# EAGLE design Wio Terminal Chassis - LoRa-E5 and GNSS v1.2 (EAGLE 6.4)
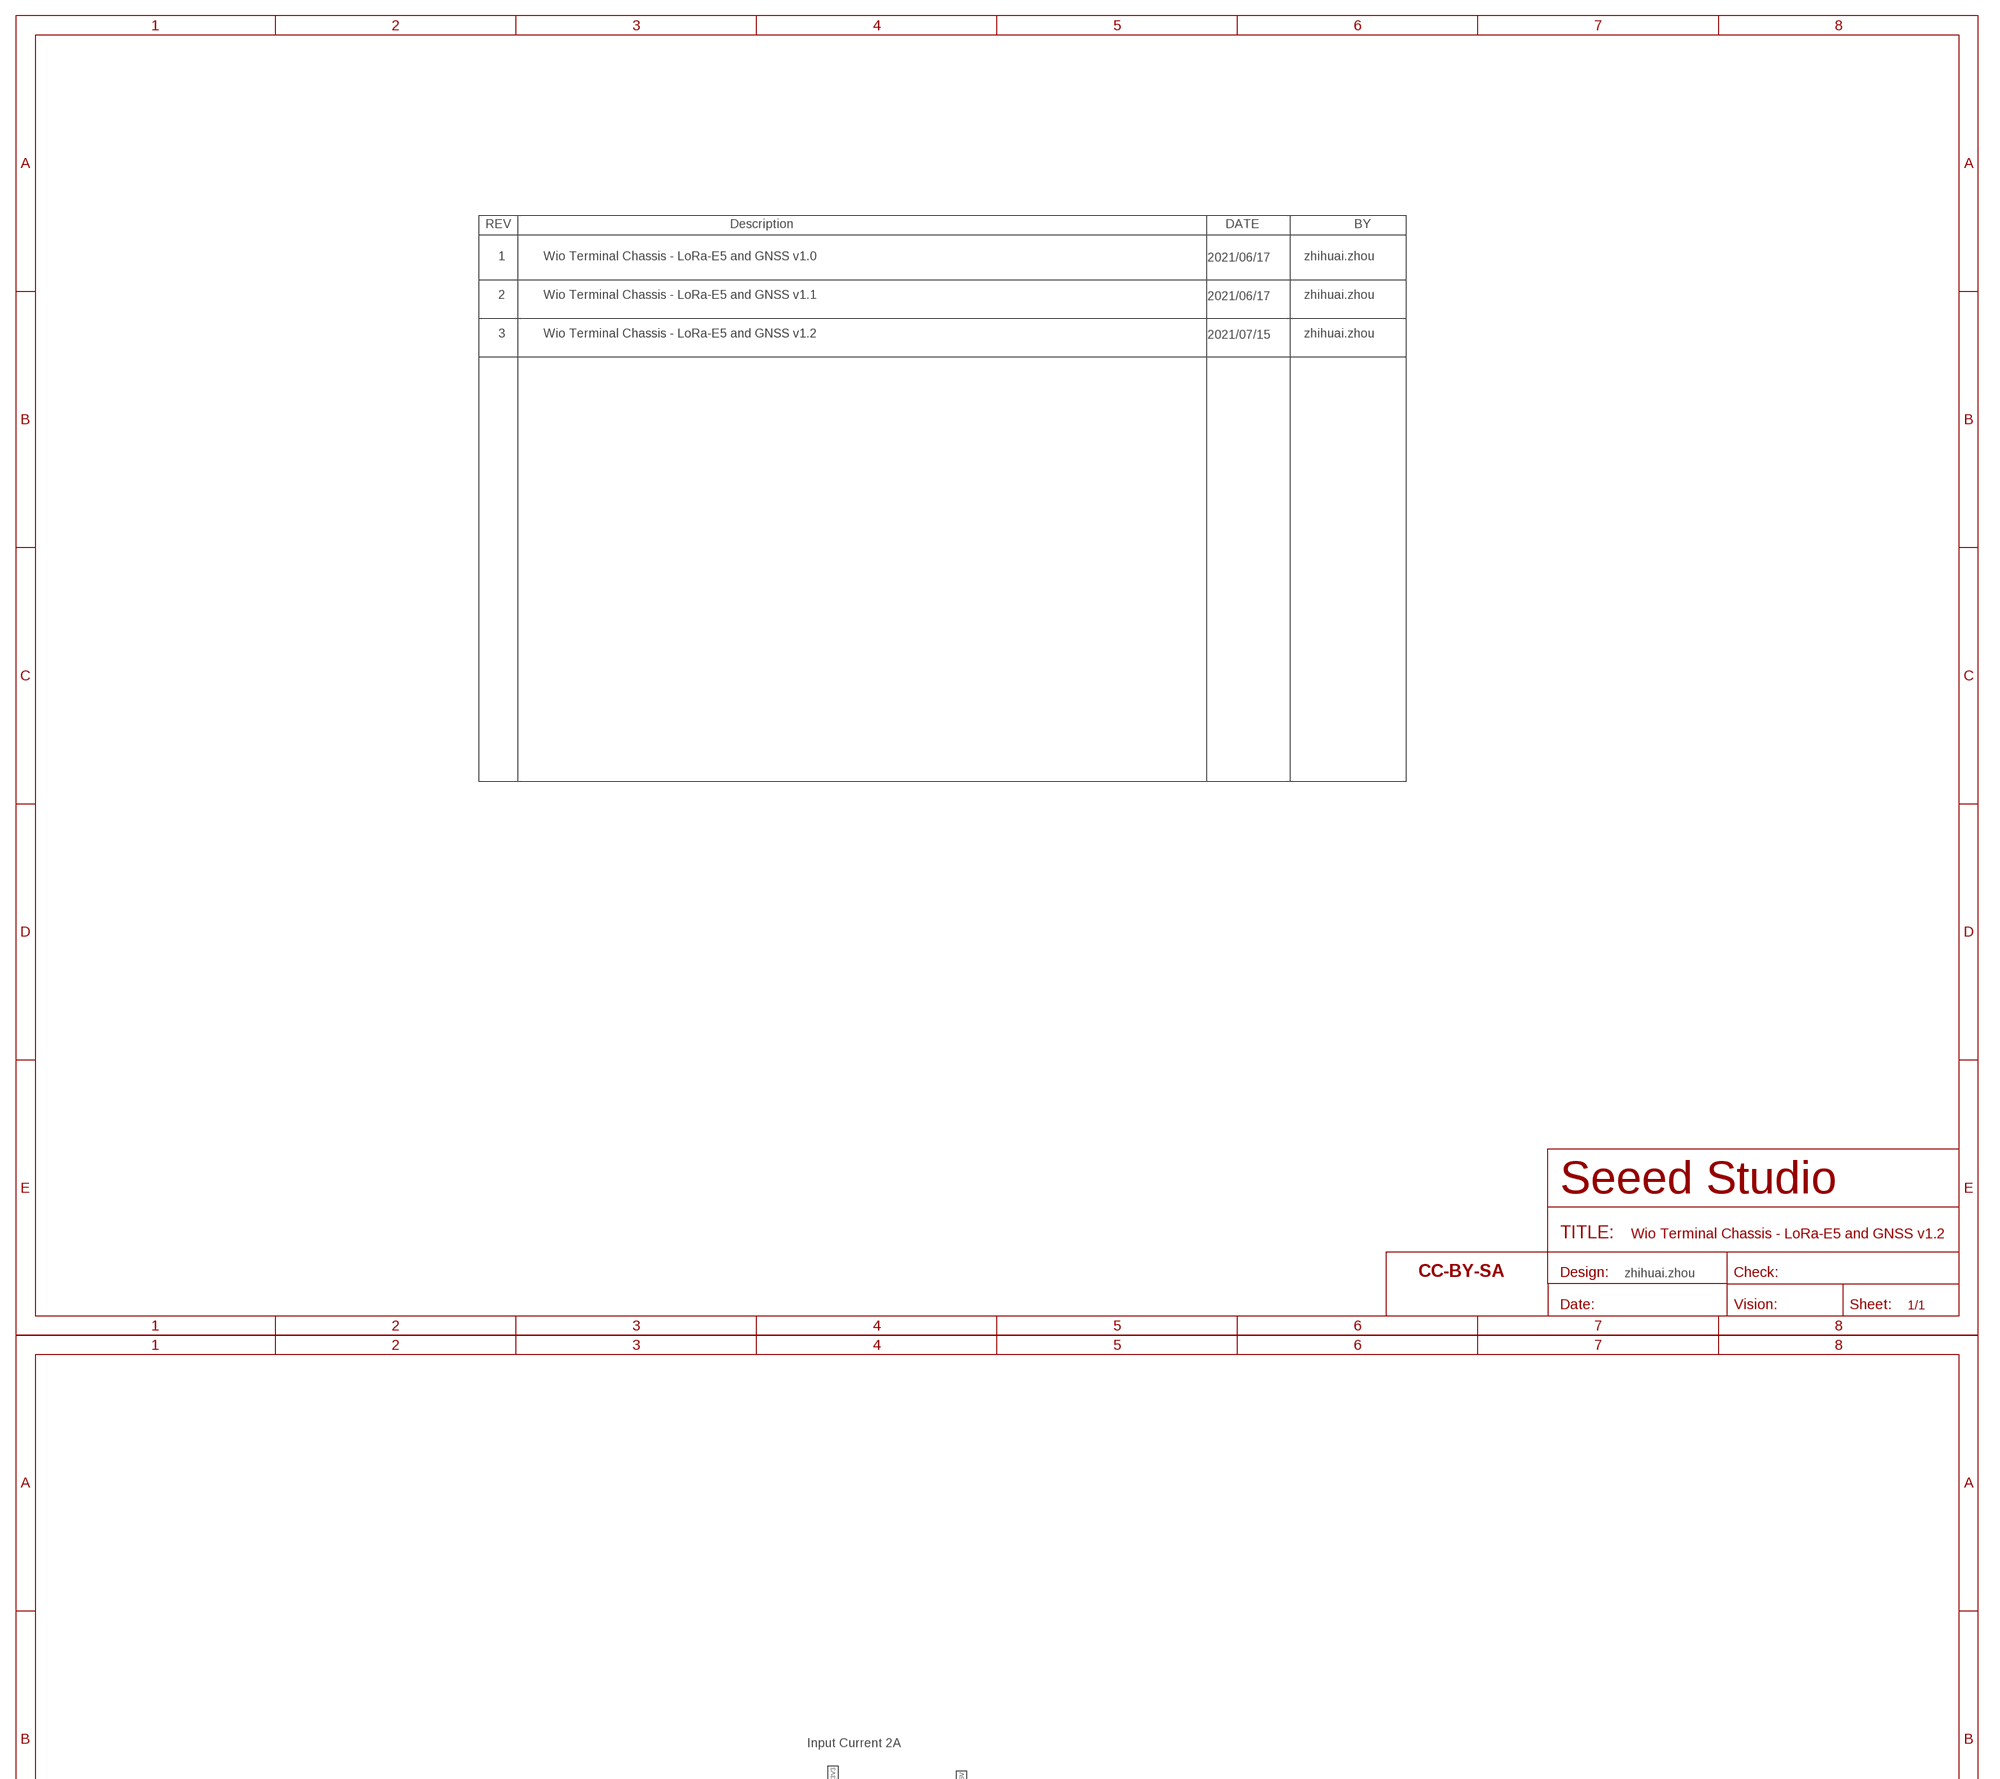
[diagram p0: schematic, sheet 1, part 1 of 2]
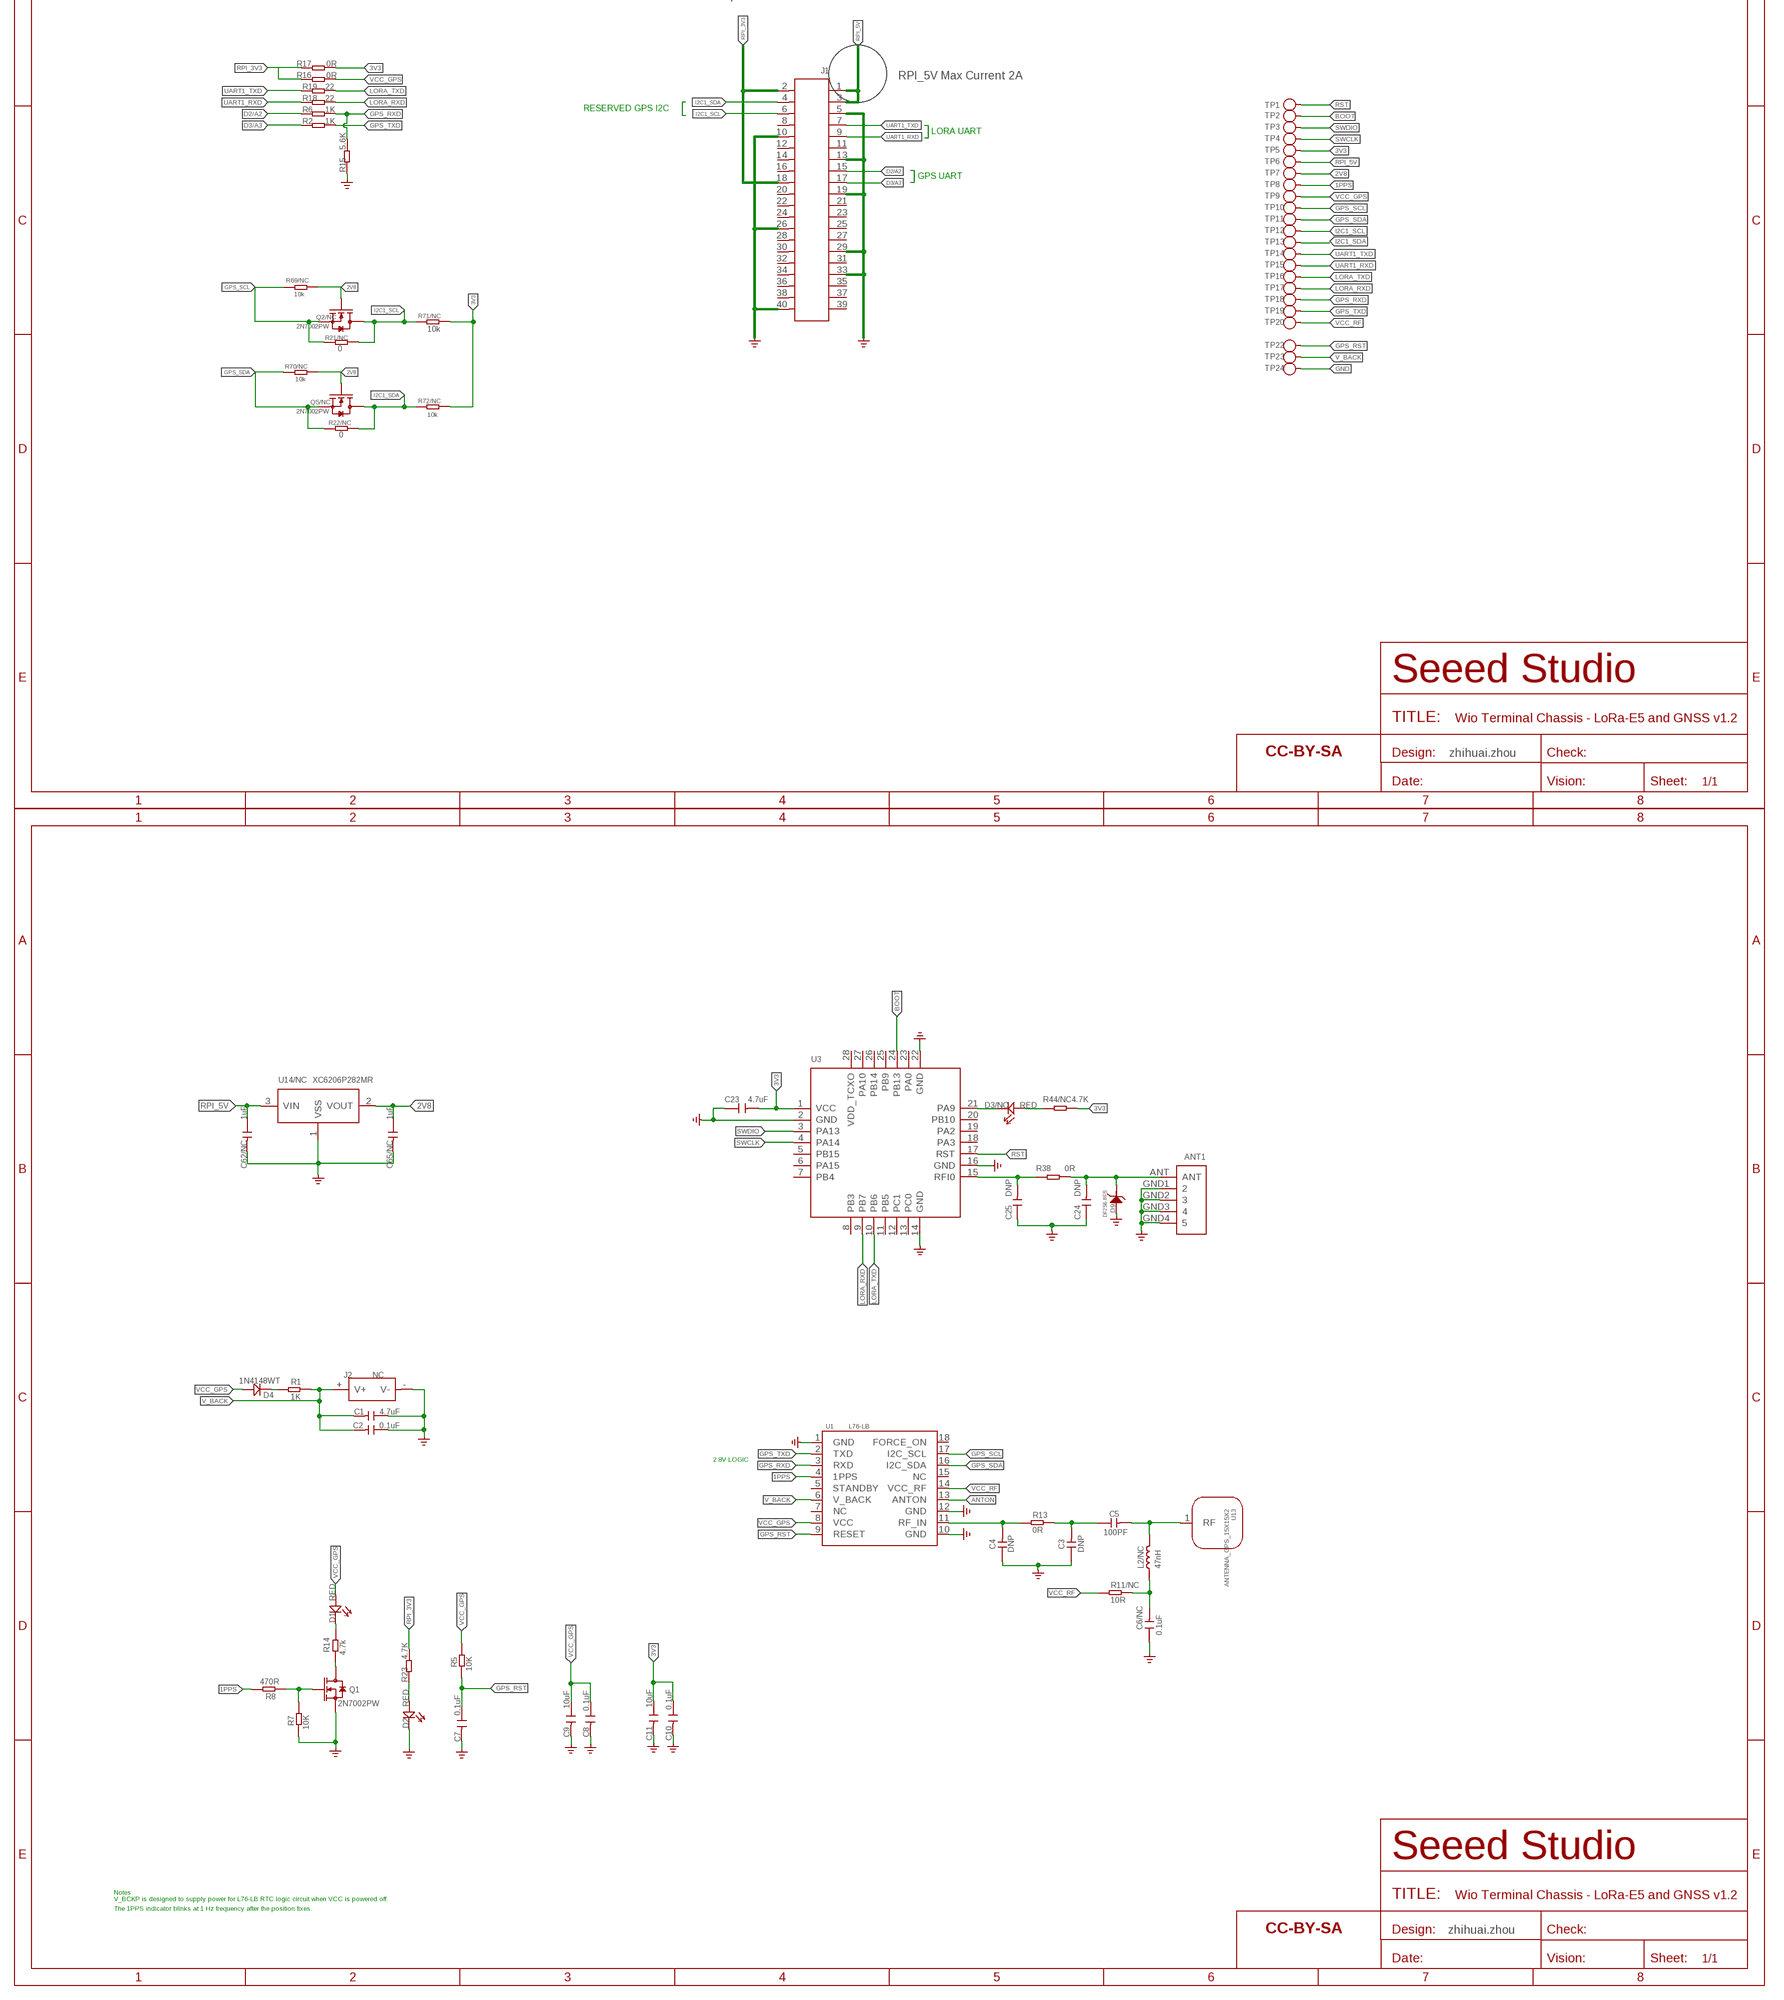
[diagram p1: schematic, sheet 1, part 2 of 2]

## Parts
ANT1  ANTENNA-SMA-MCX-JE-320160125  [SMA5P-SMD-5.1-6.5X6.5X16.5MM]
C1  4.7uF  CAP-0603  [C0603]
C2  0.1uF  CAP-0603  [C0603]
C3  DNP  CAP-0603  [C0603]
C4  DNP  CAP-0603  [C0603]
C5  100PF  CAP-0603  [C0603]
C6/NC  0.1uF  CAP-0603  [C0603]
C7  0.1uF  CAP-0603  [C0603]
C8  0.1uF  CAP-0603  [C0603]
C9  10uF  CAP-0603  [C0603]
C10  0.1uF  CAP-0603  [C0603]
C11  10uF  CAP-0603  [C0603]
C23  4.7uF  CAP-0603  [C0603]
C24  DNP  CAP-0603  [C0603]
C25  DNP  CAP-0603  [C0603]
C62/NC  1uF  CAP-0603  [C0603]
C65/NC  1uF  CAP-0603  [C0603]
D1  RED  LED'0603'  [LED-0603]
D2  RED  LED'0603'  [LED-0603]
D3/NC  RED  LED'0603'  [LED-0603]
D4  1N4148WT  DIODE'0805'  [SOD-323]
D9  DF2S6.8FS  D-ESD-2P'DF2S6.8FS'  [SOD-923]
J1  HEADER-2X20P-SMD-SMD  [H2X20-SMD-2.54]
J2  NC  HOLDER-BAT  [SMD-CR1220-2]
L2/NC  47nH  INDUCTOR/FERRITE-BEAD'0603'  [L0603]
Q1  2N7002PW  MOSFET-N-SOT23  [SOT-23]
Q2/NC  2N7002PW  MOSFET-N-SOT23  [SOT-23]
Q5/NC  2N7002PW  MOSFET-N-SOT23  [SOT-23]
R1  1K  RES-0603  [R0603]
R2  1K  RES-0603  [R0603]
R5  10K  RES-0603  [R0603]
R6  1K  RES-0603  [R0603]
R7  10K  RES-0603  [R0603]
R8  470R  RES-0603  [R0603]
R11/NC  10R  RES-0603  [R0603]
R13  0R  RES-0603  [R0603]
R14  4.7k  RES-0603  [R0603]
R15  5.6K  RES-0603  [R0603]
R16  0R  RES-0603  [R0603]
R17  0R  RES-0603  [R0603]
R18  22  RES-0603  [R0603]
R19  22  RES-0603  [R0603]
R21/NC  0  RES-0603  [R0603]
R22/NC  0  RES-0603  [R0603]
R23  4.7K  RES-0603  [R0603]
R38  0R  RES-0603  [R0603]
R44/NC  4.7K  RES-0603  [R0603]
R69/NC  10k  RES-0603  [R0603]
R70/NC  10k  RES-0603  [R0603]
R71/NC  10k  RES-0603  [R0603]
R72/NC  10k  RES-0603  [R0603]
TP1  TEST  TEST-POINT'4545'  [TP-D45MIL]
TP2  TEST  TEST-POINT'4545'  [TP-D45MIL]
TP3  TEST  TEST-POINT'4545'  [TP-D45MIL]
TP4  TEST  TEST-POINT'4545'  [TP-D45MIL]
TP5  TEST  TEST-POINT'4545'  [TP-D45MIL]
TP6  TEST  TEST-POINT'4545'  [TP-D45MIL]
TP7  TEST  TEST-POINT'4545'  [TP-D45MIL]
TP8  TEST  TEST-POINT'4545'  [TP-D45MIL]
TP9  TEST  TEST-POINT'4545'  [TP-D45MIL]
TP10  TEST  TEST-POINT'4545'  [TP-D45MIL]
TP11  TEST  TEST-POINT'4545'  [TP-D45MIL]
TP12  TEST  TEST-POINT'4545'  [TP-D45MIL]
TP13  TEST  TEST-POINT'4545'  [TP-D45MIL]
TP14  TEST  TEST-POINT'4545'  [TP-D45MIL]
TP15  TEST  TEST-POINT'4545'  [TP-D45MIL]
TP16  TEST  TEST-POINT'4545'  [TP-D45MIL]
TP17  TEST  TEST-POINT'4545'  [TP-D45MIL]
TP18  TEST  TEST-POINT'4545'  [TP-D45MIL]
TP19  TEST  TEST-POINT'4545'  [TP-D45MIL]
TP20  TEST  TEST-POINT'4545'  [TP-D45MIL]
TP22  TEST  TEST-POINT'4545'  [TP-D45MIL]
TP23  TEST  TEST-POINT'4545'  [TP-D45MIL]
TP24  TEST  TEST-POINT'4545'  [TP-D45MIL]
U1  L76-LB  GPS_MODULE_L76-LB  [GPS_MODULE_L76-LB]
U3  MOUDLE_LORA_E5  [MOUDLE28P-1.25-12X12X2.5MM]
U13  ANTENNA_GPS_15X15X2  [ANTENNA_GPS_15X15X2]
U14/NC  XC6206P282MR  PMIC-XC6206PMR  [SOT-23]

## Nets
1PPS: R8.2 TP8.T U1.4(1PPS)
2V8: C65/NC.1 Q2/NC.1(G) Q5/NC.1(G) R69/NC.2 R70/NC.2 TP7.T U14/NC.2(VOUT)
3V3: C10.1 C11.1 C23.2 R17.2 R44/NC.2 R71/NC.2 R72/NC.2 TP5.T U3.1(VCC)
ANTON: U1.13(ANTON)
BOOT: TP2.T U3.24(PB13)
D2/A2: J1.15 R6.1
D3/A3: J1.17 R2.1
GND: ANT1.GND1 ANT1.GND2 ANT1.GND3 ANT1.GND4 C1.1 C2.1 C3.1 C4.1 C6/NC.1 C7.2 C8.2 C9.2 C10.2 C11.2 C23.1 C24.1 C25.1 C62/NC.2 C65/NC.2 D2.- D9.2 J1.5 J1.10 J1.13 J1.19 J1.26 J1.29 J1.33 J1.40 J2.-(V-) Q1.2(S) R7.1 R15.1 TP24.T U1.1(GND) U1.10(GND) U1.12(GND) U3.2(GND) U3.14(GND) U3.16(GND) U3.22(GND) U14/NC.1(VSS) ; supply symbol labelled GND_POWER
GPS_RST: C7.1 R5.1 TP22.T U1.9(RESET)
GPS_RXD: R6.2 R15.2 TP18.T U1.3(RXD)
GPS_SCL: Q2/NC.2(S) R21/NC.1 R69/NC.1 TP10.T U1.17(I2C_SCL)
GPS_SDA: Q5/NC.2(S) R22/NC.1 R70/NC.1 TP11.T U1.16(I2C_SDA)
GPS_TXD: R2.2 TP19.T U1.2(TXD)
I2C1_SCL: J1.6 Q2/NC.3(D) R21/NC.2 R71/NC.1 TP12.T
I2C1_SDA: J1.4 Q5/NC.3(D) R22/NC.2 R72/NC.1 TP13.T
LORA_RXD: R18.2 TP17.T U3.9(PB7)
LORA_TXD: R19.2 TP16.T U3.10(PB6)
N$7: Q1.3(D) R14.2
N$8: Q1.1(G) R7.2 R8.1
N$10: D1.- R14.1
N$11: D4.- R1.1
N$15: C6/NC.2 L2/NC.1 R11/NC.2
N$16: C4.2 R13.1 U1.11(RF_IN)
N$18: C5.2 L2/NC.2 U13.1(RF)
N$19: C3.2 C5.1 R13.2
N$20: D2.+ R23.1
N$26: ANT1.ANT C24.2 D9.1 R38.2
N$40: C25.2 R38.1 U3.15(RFI0)
N$45: D3/NC.+ R44/NC.1
N$48: D3/NC.- U3.21(PA9)
RPI_3V3: J1.2 J1.18 R16.1 R17.1 R23.2
RPI_5V: C62/NC.1 J1.1 J1.3 TP6.T U14/NC.3(VIN)
RST: TP1.T U3.17(RST)
SWCLK: TP4.T U3.4(PA14)
SWDIO: TP3.T U3.3(PA13)
UART1_RXD: J1.9 R18.1 TP15.T
UART1_TXD: J1.7 R19.1 TP14.T
V_BACK: C1.2 C2.2 J2.+(V+) R1.2 TP23.T U1.6(V_BACK)
VCC_GPS: C8.1 C9.1 D1.+ D4.+ R5.2 R16.2 TP9.T U1.8(VCC)
VCC_RF: R11/NC.1 TP20.T U1.14(VCC_RF)
Unconnected: J1.8 J1.11 J1.12 J1.14 J1.16 J1.20 J1.21 J1.22 J1.23 J1.24 J1.25 J1.27 J1.28 J1.30 J1.31 J1.32 J1.34 J1.35 J1.36 J1.37 J1.38 J1.39 U1.5(STANDBY) U1.7(NC) U1.15(NC) U1.18(FORCE_ON) U3.5(PB15) U3.6(PA15) U3.7(PB4) U3.8(PB3) U3.11(PB5) U3.12(PC1) U3.13(PC0) U3.18(PA3) U3.19(PA2) U3.20(PB10) U3.23(PA0) U3.25(PB9) U3.26(PB14) U3.27(PA10) U3.28(VDD_TCXO)

## Notes on the sheet
- 1 | Wio Terminal Chassis - LoRa-E5 and GNSS v1.0 | 2021/06/17 | zhihuai.zhou
- 2 | Wio Terminal Chassis - LoRa-E5 and GNSS v1.1 | 2021/06/17 | zhihuai.zhou
- 3 | Wio Terminal Chassis - LoRa-E5 and GNSS v1.2 | 2021/07/15 | zhihuai.zhou
- zhihuai.zhou
- Input Current 2A
- RPI_5V Max Current 2A
- RESERVED GPS I2C
- LORA UART
- GPS UART
- zhihuai.zhou
- 2.8V LOGIC
- Notes:
  V_BCKP is designed to supply power for L76-LB RTC logic circuit when VCC is powered off.
- The 1PPS indicator blinks at 1 Hz frequency after the position fixes.
- zhihuai.zhou

## Library data of the parts
ANT1 = ANTENNA-SMA-MCX-JE:ANTENNA-SMA-MCX-JE
C1-C5 C6/NC C7-C11 C23-C25 C62/NC C65/NC = Discrete-new:CAP: Ceramic Capacitors
D1 D2 D3/NC = Discrete-new:LED
D4 = Discrete-new:DIODE
D9 = Discrete-new:D-ESD-2P: SOD-923:304060009;SOD-123:304060001
J1 = HEADER-2X20P-SMD:HEADER-2X20P-SMD
J2 = HOLDER-BAT:HOLDER-BAT: button cell holder
L2/NC = Discrete-new:INDUCTOR/FERRITE-BEAD
Q1 Q2/NC Q5/NC = Discrete-new:MOSFET-N: IRLL014: http://www.vishay.com/docs/91319/sihll014.pdf
R1 R2 R5-R8 R11/NC R13-R19 R21/NC R22/NC R23 R38 R44/NC R69/NC R70/NC R71/NC R72/NC = Discrete-new:RES
TP1-TP20 TP22-TP24 = Discrete-new:TEST-POINT; PARTNO: DNP
U1 = GPS_MODULE_L76-LB:GPS_MODULE_L76-LB
U3 = MOUDLE_LORA_E5:MOUDLE_LORA_E5
U13 = ANTENNA_GPS_15X15X2:ANTENNA_GPS_15X15X2
U14/NC = IC-new:PMIC-XC6206P: LOW ESR Cap.Compatible Positive Voltage Regulators

## Board
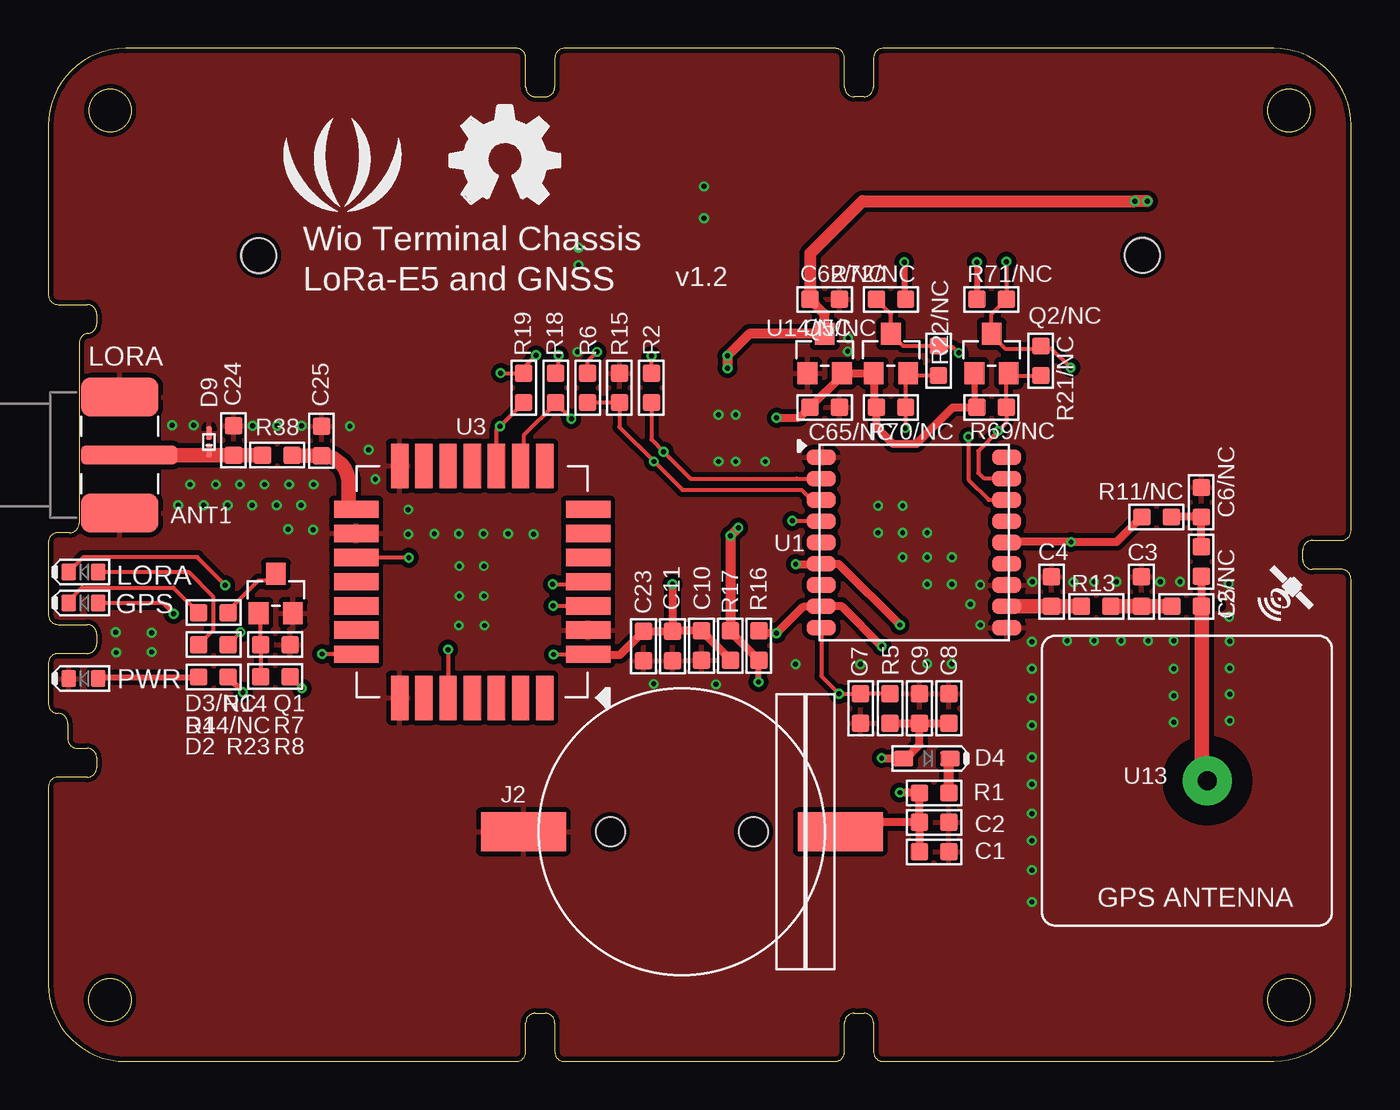
[diagram p2: board, top side]
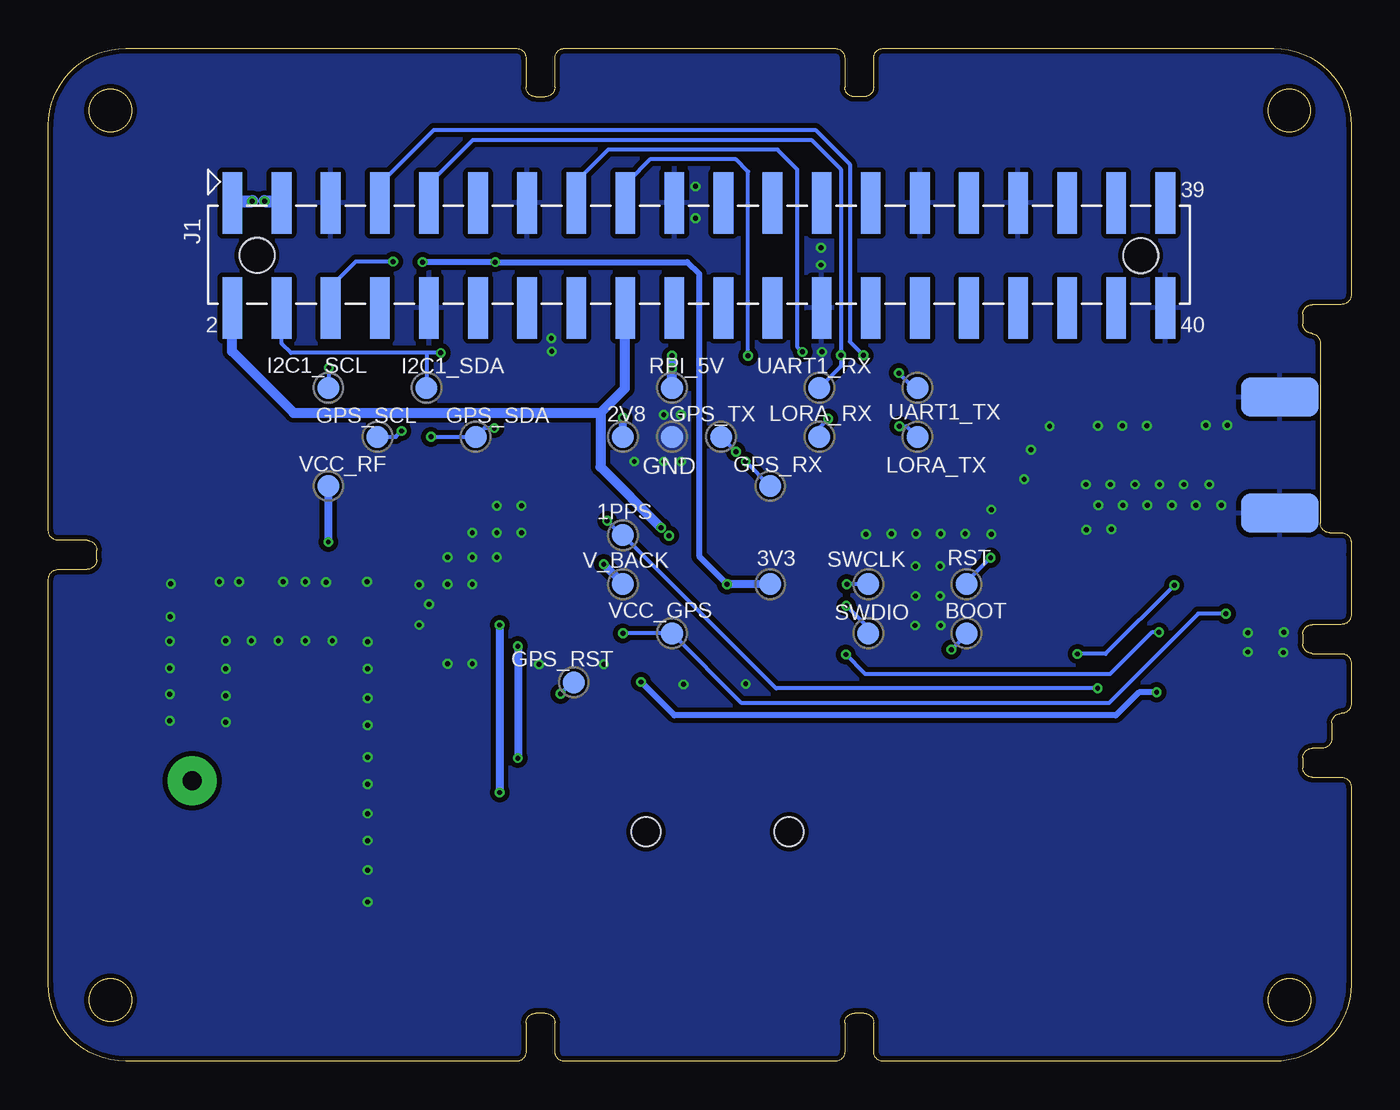
[diagram p3: board, bottom side, seen from below]

Size 67.41 x 52.4 mm. Coordinates in mm from the lower left corner, seen from the top.
Outline: 67.4,4.01 67.4,24.95 arc90 66.9,25.45 65.4,25.45 arc-90 64.9,25.95 64.9,26.45 arc-90 65.4,26.95 66.9,26.95 arc90 67.4,27.45 67.4,48.42 arc90 63.4,52.4 43.2,52.4 arc90 42.7,51.9 42.7,50.4 arc-90 42.2,49.9 41.7,49.9 arc-90 41.2,50.4 41.2,51.9 arc90 40.7,52.4 26.7,52.4 arc90 26.2,51.9 26.2,50.4 arc-90 25.7,49.9 25.2,49.9 arc-90 24.7,50.4 24.7,51.9 arc90 24.2,52.4 4,52.4 arc90 0,48.4 0,39.65 arc90 0.5,39.15 2,39.15 arc-90 2.5,38.65 2.5,38.15 arc-84 2.05,37.65 arc84 1.6,37.16 1.6,27.85 arc-90 1.1,27.35 0.5,27.35 arc90 0,26.85 0,23.1 arc90 0.5,22.6 2,22.6 arc-90 2.5,22.1 2.5,21.6 arc-90 2,21.1 0.5,21.1 arc90 0,20.6 0,18.5 arc90 0.5,18 arc-90 1,17.5 1,16.7 arc90 1.5,16.2 2,16.2 arc-90 2.5,15.7 2.5,15.2 arc-90 2,14.7 0.5,14.7 arc90 0,14.2 0,4 arc90 4,0 24.2,0 arc90 24.7,0.5 24.7,2 arc-90 25.2,2.5 25.7,2.5 arc-90 26.2,2 26.2,0.5 arc90 26.7,0 40.7,0 arc90 41.2,0.5 41.2,2 arc-90 41.7,2.5 42.2,2.5 arc-90 42.7,2 42.7,0.5 arc90 43.2,0 63.4,0
Outline: 0,26.89 0,26.21
Outline: 63.41,0.01 arc90 67.41,4.01
Outline: circle at 64.2,49.18 radius 1.1
Outline: circle at 3.2,49.18 radius 1.1
Outline: circle at 3.2,3.18 radius 1.1
Outline: circle at 64.2,3.18 radius 1.1
Copper layers (1*16): Top 0.035mm / dielectric 1mm / Bottom 0.035mm
Design rules "SeeedStudio_4layer_DRU_no_angle_20140221 *": minimum track width 1mil, minimum drill 10mil, track to track 4mil, track to pad 4mil, pad to pad 4mil, via to via 4mil, smd to smd 0mil, copper to edge 10mil, drill to drill 8mil, minimum pad ring 4mil, minimum via ring 4mil, stop-mask expansion 2mil, vias tented up to drill 25mil, thermal gap 10mil
Holes 1.8 mm at 56.61,41.7 10.89,41.68
tRestrict: area 60.4,23.5 to 60.7,23.7; area 0.5,28.1 to 4.5,32.1; area 1.8,28.1 to 5.6,34.7

### Footprints (pad centres in the part's own frame; a part is rotated, then mirrored left to right if it is on the bottom)
SMA5P-SMD-5.1-6.5X6.5X16.5MM = smd 5 x 1: ANT 0.5,0 | smd 4 x 2: GND1 0,3; GND2 0,-3 | smd 4 x 2 bottom: GND3 0,3; GND4 0,-3
C0603 = smd 0.889 x 0.889: 1 0,0.762; 2 0,-0.762
LED-0603 = smd 0.762 x 0.889: + 0.762,0; - -0.762,0
SOD-323 = smd 1 x 0.8: + 1.2,0; - -1.2,0
SOD-923 = smd 0.7 x 0.3: 1 -0.45,0; 2 0.45,0
H2X20-SMD-2.54 = smd 1.02 x 3.17 bottom: 1 -24.13,-2.715; 2 -24.13,2.715; 3 -21.59,-2.715; 4 -21.59,2.715; 5 -19.05,-2.715; 6 -19.05,2.715; 7 -16.51,-2.715; 8 -16.51,2.715; 9 -13.97,-2.715; 10 -13.97,2.715; 11 -11.43,-2.715; 12 -11.43,2.715; 13 -8.89,-2.715; 14 -8.89,2.715; 15 -6.35,-2.715; 16 -6.35,2.715; 17 -3.81,-2.715; 18 -3.81,2.715; 19 -1.27,-2.715; 20 -1.27,2.715; 21 1.27,-2.715; 22 1.27,2.715; 23 3.81,-2.715; 24 3.81,2.715; 25 6.35,-2.715; 26 6.35,2.715; 27 8.89,-2.715; 28 8.89,2.715; 29 11.43,-2.715; 30 11.43,2.715; 31 13.97,-2.715; 32 13.97,2.715; 33 16.51,-2.715; 34 16.51,2.715; 35 19.05,-2.715; 36 19.05,2.715; 37 21.59,-2.715; 38 21.59,2.715; 39 24.13,-2.715; 40 24.13,2.715 | hole 1.8: -22.86,0; 22.86,0
SMD-CR1220-2 = smd 2 x 4.4: + 0,-8.2; - 0,8.2 | hole 1.5: 0,3.7; 0,-3.7
L0603 = smd 0.889 x 0.889: 1 -0.762,0; 2 0.762,0
SOT-23 = smd 1.143 x 1.016: 1 1.016,-0.889; 2 1.016,0.889; 3 -1.016,0
R0603 = smd 0.889 x 0.889: 1 0,0.762; 2 0,-0.762
TP-D45MIL = smd 1.143 x 1.143: T 0,0
GPS_MODULE_L76-LB = smd 1.5 x 0.8: 1 -4.8,4.4; 2 -4.8,3.3; 3 -4.8,2.2; 4 -4.8,1.1; 5 -4.8,0; 6 -4.8,-1.1; 7 -4.8,-2.2; 8 -4.8,-3.3; 9 -4.8,-4.4; 10 4.8,-4.4; 11 4.8,-3.3; 12 4.8,-2.2; 13 4.8,-1.1; 14 4.8,0; 15 4.8,1.1; 16 4.8,2.2; 17 4.8,3.3; 18 4.8,4.4
MOUDLE28P-1.25-12X12X2.5MM = smd 2.3 x 0.9: 1 -6,3.75; 2 -6,2.5; 3 -6,1.25; 4 -6,0; 5 -6,-1.25; 6 -6,-2.5; 7 -6,-3.75; 15 6,-3.75; 16 6,-2.5; 17 6,-1.25; 18 6,0; 19 6,1.25; 20 6,2.5; 21 6,3.75 | smd 0.9 x 2.3: 8 -3.75,-6; 9 -2.5,-6; 10 -1.25,-6; 11 0,-6; 12 1.25,-6; 13 2.5,-6; 14 3.75,-6; 22 3.75,6; 23 2.5,6; 24 1.25,6; 25 0,6; 26 -1.25,6; 27 -2.5,6; 28 -3.75,6
ANTENNA_GPS_15X15X2 = drill 1 pad 2.54: 1 0,1.05
SOT-23' = smd 1.016 x 1.143: 1 -0.889,-1.016; 2 0.889,-1.016; 3 0,1.016

### Placement (x,y rotation side)
ANT1  3.69,31.36 0 top
C1  45.83,10.84 270 top
C2  45.83,12.36 270 top
C3  56.55,24.3 0 top
C4  51.9,24.3 0 top
C5  58.89,23.54 90 top
C6/NC  59.65,28.93 0 top
C7  42.02,18.26 0 top
C8  46.6,18.26 180 top
C9  45.07,18.26 180 top
C10  33.79,21.51 0 top
C11  32.3,21.48 0 top
C23  30.8,21.48 180 top
C24  9.59,32.13 0 top
C25  14.13,32.1 0 top
C62/NC  40.17,39.42 90 top
C65/NC  40.17,33.83 90 top
D1  1.82,23.72 0 top
D2  1.82,19.81 0 top
D3/NC  1.82,25.32 0 top
D4  45.45,15.67 180 top
D9  8.32,32.05 90 top
J1  33.75,41.69 180 top
J2  32.78,11.88 90 top
L2/NC  59.65,25.85 270 top
Q1  11.77,24.2 270 top
Q2/NC  48.81,36.62 270 top
Q5/NC  43.6,36.62 270 top
R1  45.83,13.89 270 top
R2  31.2,34.84 0 top
R5  43.55,18.26 0 top
R6  27.9,34.84 0 top
R7  11.75,21.56 270 top
R8  11.75,19.91 90 top
R11/NC  57.34,28.16 90 top
R13  54.22,23.54 90 top
R14  8.55,23.21 90 top
R15  29.55,34.84 0 top
R16  36.77,21.51 180 top
R17  35.29,21.51 0 top
R18  26.25,34.84 0 top
R19  24.6,34.84 0 top
R21/NC  51.35,36.24 180 top
R22/NC  46.06,36.24 180 top
R23  8.55,19.88 90 top
R38  11.85,31.36 270 top
R44/NC  8.55,21.56 90 top
R69/NC  48.81,33.83 270 top
R70/NC  43.6,33.83 270 top
R71/NC  48.81,39.42 270 top
R72/NC  43.6,39.42 90 top
TP1  19.9,24.68 0 bottom
TP2  19.9,22.14 0 bottom
TP3  24.98,22.14 0 bottom
TP4  24.98,24.68 0 bottom
TP5  30.06,24.68 0 bottom
TP6  35.14,34.84 0 bottom
TP7  37.68,32.3 0 bottom
TP8  37.68,27.22 0 bottom
TP9  35.14,22.14 0 bottom
TP10  50.38,32.3 0 bottom
TP11  45.3,32.3 0 bottom
TP12  52.92,34.84 0 bottom
TP13  47.84,34.84 0 bottom
TP14  22.44,34.84 0 bottom
TP15  27.52,34.84 0 bottom
TP16  22.44,32.3 0 bottom
TP17  27.52,32.3 0 bottom
TP18  30.06,29.76 0 bottom
TP19  32.6,32.3 0 bottom
TP20  52.92,29.76 0 bottom
TP22  40.22,19.6 0 bottom
TP23  37.68,24.68 0 bottom
TP24  35.14,32.3 0 bottom
U1  44.79,26.84 0 top
U3  21.93,24.81 180 top
U13  58.91,14.52 270 top
U14/NC  XC6206P282MR  [SOT-23']  40.17,36.62 0 top
U$16  [OSHW_FILLX200_NOTEXT]  20.79,44.37 0 top
U$17  [LOGO_SILK]  15.2,45.64 0 top

### Tracks (layer width: path | path; a pad name or v marks a point on that pad's centre or on a via)
1PPS  (via drill 0.25 pad 0.51)
  Top 0.203: v38.49,27.96 39.97,27.96 U1.4 | R8.2 v13.12,19.3
  Bottom 0.203: v38.49,27.96 37.76,27.22 TP8.T 29.75,19.3 v13.12,19.3
2V8  (via drill 0.25 pad 0.51)
  Top 0.305: Q2/NC.1 47.92,33.95 R69/NC.2
  Top 0.406: v37.68,33.29 38.87,33.29 C65/NC.1 41.06,35.48 U14/NC.2 Q5/NC.1 42.71,33.95 R70/NC.2 42.84,32.81 43.7,31.95 44.92,31.95 46.8,33.83 R69/NC.2 48.04,33.8 47.97,33.8
  Bottom 0.406: TP7.T v37.68,33.29
3V3  (via drill 0.25 pad 0.51)
  Top 0.203: R44/NC.2 v9.94,22.19 | v26.15,21.05 27.92,21.05 U3.1
  Top 0.305: 27.97,21.03 U3.1 | v48.04,41.35 R71/NC.2 | v44.28,41.35 44.28,39.49 R72/NC.2
  Top 0.406: R17.2 35.29,20.77 C10.1 32.32,22.27 C11.1 | C11.1 C23.2 29.58,21.03 27.97,21.03 | v32.29,24.68 C11.1
  Bottom 0.203: v9.94,22.19 10.32,22.19 12.48,20.04 25.13,20.04 v26.15,21.05
  Bottom 0.305: v48.04,41.35 v44.28,41.35 34.35,41.35 33.74,40.74 33.74,26.13 v32.29,24.68
  Bottom 0.406: TP5.T v32.29,24.68
BOOT  (via drill 0.25 pad 0.51)
  Top 0.203: v20.69,21.31 U3.24
  Bottom 0.203: TP2.T 19.9,22.09 v20.69,21.31
D2/A2  (via drill 0.25 pad 0.51)
  Top 0.203: R6.1 27.9,36.22 v28.38,36.7
  Bottom 0.203: 40.1,43.49 J1.15 40.22,44.52 40.22,45.38 38.44,47.16 29.68,47.16 28.66,46.15 28.66,36.98 v28.38,36.7
D3/A3  (via drill 0.25 pad 0.51)
  Top 0.203: R2.1 v31.2,36.49
  Bottom 0.203: 37.56,43.23 J1.17 37.43,44.54 37.43,45.51 36.28,46.65 31.84,46.65 31.2,46.02 v31.2,36.49
GND  (via drill 0.25 pad 0.51)
  other vias: 58.55,24.81 57.54,24.81 55.25,24.81 54.11,24.81 53.04,24.78 56.9,21.76 55.51,21.76 54.11,21.76 52.71,21.76 50.91,24.81 27.44,41.19 33.92,45.26 33.92,43.61 27.39,36.7 34.68,31.03 35.57,31.03 37.09,31.03 61.07,24.71 19.97,27.3 21.24,27.3 22.51,27.3 23.78,27.3 21.27,25.62 22.54,25.62 21.27,24.07 22.54,24.07 34.55,19.5 45.47,24.68 46.74,24.68 44.2,26.08 45.47,26.08 46.74,26.08 42.93,27.35 44.2,27.35 45.47,27.35 42.93,28.75 44.2,28.75 31.33,19.53 50.88,21.71 50.88,20.31 50.88,18.79 50.88,17.39 50.88,11.42 50.88,9.9 50.88,8.25 50.88,14.35 50.88,15.74 50.88,12.82 35.57,33.45 34.68,33.45 41.36,36.72 41.38,37.41 48.22,24.66 47.71,23.64 48.22,22.58 27.44,42.08 61.09,23.01 61.12,21.74 21.24,22.55 22.56,22.55 18.63,28.54 18.63,27.27 25.1,27.27 9.28,28.77 10.55,28.77 11.82,28.77 13.09,28.77 8.03,28.77 6.71,28.77 12.4,27.53 9.91,29.84 11.18,29.84 12.45,29.84 13.72,29.84 8.67,29.84 7.35,29.84 13.7,27.5 10.57,32.89 11.84,32.89 13.11,32.89 7.53,32.91 15.6,32.86 16.57,31.64 16.92,30.12 58.22,21.76 58.22,20.31 58.22,18.92 58.22,17.55 61.12,20.34 61.12,18.99 61.12,17.62 42.02,20.54 38.67,20.54 45.47,20.57 46.74,20.57 3.49,22.19 5.34,22.17 3.51,21.15 5.34,21.18 6.41,32.91
  pour Top (isolate 0.254, rank 6): -0.42,52.62 67.52,52.62 67.52,-0.08 -0.42,-0.08
  pour Bottom (isolate 0.254, rank 6): -0.42,52.62 67.52,52.62 67.52,-0.08 2.12,-0.08 2.12,-1.1 -0.42,-1.1
GPS_RST  (via drill 0.25 pad 0.51)
  Top 0.203: 42.05,19.04 C7.1 | R5.1 C7.1 | C7.1 v40.91,19.02 39.99,19.93 U1.9
  Bottom 0.203: TP22.T 40.32,19.6 v40.91,19.02
GPS_RXD  (via drill 0.25 pad 0.51)
  Top 0.203: R6.2 R15.2 29.55,32.81 v31.33,31.03 32.8,29.56 38.97,29.56 39.53,29 39.95,29 U1.3
  Bottom 0.203: v31.33,31.03 TP18.T
GPS_SCL  (via drill 0.25 pad 0.51)
  Top 0.203: 49.57,35.48 R69/NC.1 49.57,33.04 v49.13,32.61 49.13,32.58 48.12,31.57 48.12,30.45 48.4,30.17 49.56,30.17 U1.17 | 49.57,35.48 Q2/NC.2 | 49.57,35.48 R21/NC.1 51.37,35.45
  Bottom 0.203: TP10.T 49.44,32.3 v49.13,32.61
GPS_SDA  (via drill 0.25 pad 0.51)
  Top 0.203: R22/NC.1 44.61,35.48 | 44.61,35.48 Q5/NC.2 44.36,35.48 R70/NC.1 | 44.61,34.08 R70/NC.1 | 44.61,35.48 44.61,35.61 | 49.58,29.03 U1.16 | R70/NC.1 44.33,33.8 v44.33,32.76 | U1.16 49.25,29.04 | v47.61,32.3 47.61,30.09 48.65,29.05 49.58,29.05 U1.16
  Bottom 0.203: 45.32,32.28 TP11.T | v47.61,32.3 TP11.T | v44.33,32.76 44.84,32.76 TP11.T
GPS_TXD  (via drill 0.25 pad 0.51)
  Top 0.203: R2.2 31.2,32.18 v31.84,31.54 33.23,30.14 38.72,30.14 U1.2
  Bottom 0.203: v31.84,31.54 TP19.T
I2C1_SCL  (via drill 0.25 pad 0.51)
  Top 0.203: v52.89,35.88 51.9,36.88 51.47,36.88 R21/NC.2 51.22,36.88 49.52,36.88 48.8,37.59 Q2/NC.3 48.8,38.65 R71/NC.1 v49.57,41.37
  Top 0.305: 51.5,36.85 R21/NC.2
  Bottom 0.203: v52.89,35.88 52.89,34.87 TP12.T | 52.82,38.99 J1.6 52.97,39.15 52.97,39.9 51.5,41.37 v49.57,41.37
  Bottom 0.305: 52.61,38.15 52.77,38.3 52.77,38.94 J1.6
I2C1_SDA  (via drill 0.25 pad 0.51)
  Top 0.203: 43.57,37.61 Q5/NC.3 | Q5/NC.3 43.6,38.65 R72/NC.1 | v47.1,36.65 46.8,36.95 46.32,36.95 R22/NC.2 44.23,37 Q5/NC.3
  Bottom 0.203: J1.4 55.34,39.66 55.33,39.67 55.33,40.18 | 55.48,38.04 55.48,38.83 J1.4 | J1.4 55.33,37.13 54.85,36.65 v47.1,36.65 47.84,36.65 TP13.T
LORA_RXD  (via drill 0.25 pad 0.51)
  Top 0.203: v27.06,33.24 26.25,34.06 R18.2 26.25,34.03 24.6,32.38 24.6,30.98 U3.9
  Bottom 0.203: TP17.T 27.52,32.79 v27.06,33.24
LORA_TXD  (via drill 0.25 pad 0.51)
  Top 0.203: U3.10 23.18,32.66 v23.38,32.86 R19.2
  Bottom 0.203: 22.82,32.3 TP16.T 23,32.86 v23.38,32.86
N$7
  Top 0.203: R14.2 9.28,23.29 10.88,24.89 11.44,24.89 Q1.3
N$8
  Top 0.203: Q1.1 10.98,23.34 R7.2 R8.1
N$10
  Top 0.203: D1.- 1.05,23.82 1.74,24.51 6.46,24.51 R14.1
N$11
  Top 0.508: R1.1 46.59,15.61 D4.-
N$15
  Top 0.406: L2/NC.1 C6/NC.2 R11/NC.2
N$16
  Top 0.762: R13.1 C4.2 U1.11
N$18
  Top 0.406: L2/NC.2 C5.2
  Top 0.762: U13.1 59.96,14.54 59.68,14.83 59.68,23.52 C5.2
N$19
  Top 0.762: R13.2 C3.2 C5.1
N$20
  Top 0.305: D2.+ 2.65,19.88 R23.1
N$26
  Top 0.203: D9.1 8.32,31.41 8.37,31.36
  Top 0.762: R38.2 C24.2 8.37,31.36 ANT1.ANT
N$40
  Top 0.762: U3.15 15.53,28.56 15.53,29.94 arc90 C25.2 12.64,31.34 arc-90 R38.1
N$45
  Top 0.203: R44/NC.1 8.52,22.3 8.52,24.05 7.25,25.32 D3/NC.+
N$48  (via drill 0.25 pad 0.51)
  Top 0.203: 1.05,25.47 D3/NC.- 1.81,26.08 7.71,26.08 v9.16,24.63 | v14.16,21.08 15.92,21.08 U3.21
  Bottom 0.203: v9.16,24.63 12.71,21.08 v14.16,21.08
RPI_3V3  (via drill 0.25 pad 0.51)
  Top 0.203: R23.2 9.31,19.86 | 36.74,20.72 R16.1
  Top 0.305: 9.31,19.86 v10.07,19.1 | v36.74,19.63 36.74,20.72
  Top 0.406: R17.1 35.29,22.22 R16.1
  Top 0.508: v35.7,27.6 v35.29,27.2 R17.1 35.34,22.32
  Bottom 0.305: v10.07,19.1 10.98,19.1 12.18,17.9 35.01,17.9 v36.74,19.63
  Bottom 0.508: J1.2 57.88,37.64 | J1.18 37.58,38.95 37.58,34.82 38.85,33.55 38.85,33.5 | J1.2 | J1.2 57.9,38.95 57.9,36.72 54.72,33.55 38.9,33.55 38.85,33.5 | 38.85,33.5 38.85,30.75 v35.7,27.6
RPI_5V  (via drill 0.25 pad 0.51)
  Top 0.508: U14/NC.3 40.17,37.76 | v35.14,35.86 v35.14,36.49 36.28,37.64 40.04,37.64 40.17,37.76 | 40.17,37.76 40.17,38.65 C62/NC.1
  Top 0.61: v56.86,44.5 v56.22,44.5 42.12,44.5 39.41,41.78 C62/NC.1
  Bottom 0.508: J1.1 57.84,44.4 57.75,44.5 | TP6.T v35.14,36.49
  Bottom 0.61: 57.75,44.5 v56.86,44.5 | v56.22,44.5 55.43,44.5 J1.3
RST  (via drill 0.25 pad 0.51)
  Top 0.203: v18.65,26.06 U3.17
  Bottom 0.203: TP1.T 19.9,24.81 v18.65,26.06
SWCLK  (via drill 0.25 pad 0.51)
  Top 0.203: v26.1,24.68 27.8,24.68 U3.4
  Bottom 0.203: TP4.T v26.1,24.68
SWDIO  (via drill 0.25 pad 0.51)
  Top 0.203: v26.12,23.57 U3.3
  Bottom 0.203: TP3.T 24.98,22.42 v26.12,23.57
UART1_RXD  (via drill 0.25 pad 0.51)
  Top 0.203: R18.1 26.4,35.76 v26.4,36.52
  Bottom 0.203: J1.9 47.71,45.38 45.43,47.67 27.93,47.67 26.4,46.15 v26.4,36.52 26.4,35.96 TP15.T
UART1_TXD  (via drill 0.25 pad 0.51)
  Top 0.203: R19.1 24.6,35.68 | R19.1 24.6,35.88 v25.23,36.52 | v23.4,35.61 R19.1
  Bottom 0.203: J1.7 50.25,45.38 47.46,48.18 27.72,48.18 25.94,46.4 25.94,37.23 v25.23,36.52 | TP14.T 22.64,34.84 v23.4,35.61
V_BACK  (via drill 0.25 pad 0.51)
  Top 0.406: C2.2 R1.2 | v38.67,25.72 39.97,25.72 U1.6 40.89,25.74 v44.05,22.58 | J2.+ 41.46,12.36 C2.2 | C2.2 C1.2 | R1.2 45.07,13.99 | v44.05,13.91 45.05,13.91 R1.2
  Bottom 0.406: TP23.T 37.68,24.73 v38.67,25.72 | v44.05,22.58 v44.05,13.91
VCC_GPS  (via drill 0.25 pad 0.51)
  Top 0.203: D1.+ 5.93,23.72 v6.49,23.16
  Top 0.406: C9.1 C8.1 | v43.12,21.48 41.03,23.57 40.01,23.57 U1.8 39.96,23.52 39.05,23.52 v37.68,22.14 36.89,22.14 R16.2 | v43.12,15.69 44.23,15.69 D4.+ 44.36,15.67 45.07,16.38 C9.1 | R5.2 C9.1
  Bottom 0.203: v37.68,22.14 TP9.T 31.53,18.54 12.53,18.54 7.91,23.16 v6.49,23.16
  Bottom 0.406: v43.12,21.48 v43.12,15.69
VCC_RF  (via drill 0.25 pad 0.51)
  Top 0.406: U1.14 49.62,26.87 v52.92,26.87 55.28,26.87 R11/NC.1
  Bottom 0.406: TP20.T v52.92,26.87

### Text on the board
tPlace: Wio Terminal Chassis | LoRa-E5 and GNSS | v1.2 | LORA | LORA | GPS | PWR | GPS ANTENNA
bNames: UART1_RX | RPI_5V | I2C1_SDA | I2C1_SCL | UART1_TX | LORA_RX | GPS_TX | 2V8 | GPS_SDA | GPS_SCL | LORA_TX | GPS_RX | GND | VCC_RF | 1PPS | RST | SWCLK | 3V3 | V_BACK | BOOT | SWDIO | VCC_GPS | GPS_RST